# Altium schematic sheet Gagabiro_supply_cover.SchDoc: Gagabiro Power Supply Cover Letter
size 292 x 193 mm; CheckedBy: João Victor Colombari Carlet; Author: João Victor Colombari Carlet; CompanyName: SEL; DrawnBy: João Victor Colombari Carlet; Engineer: João Victor Colombari Carlet; Organization: SEL; Address1: EESC - USP; Address2: 400, Trabalhador São-Carlense Av.; Address3: 13566-590, São Carlos; Address4: São Paulo, Brazil; DocumentNumber: Doc Num; Revision: 0; SheetNumber: 1; SheetTotal: 4
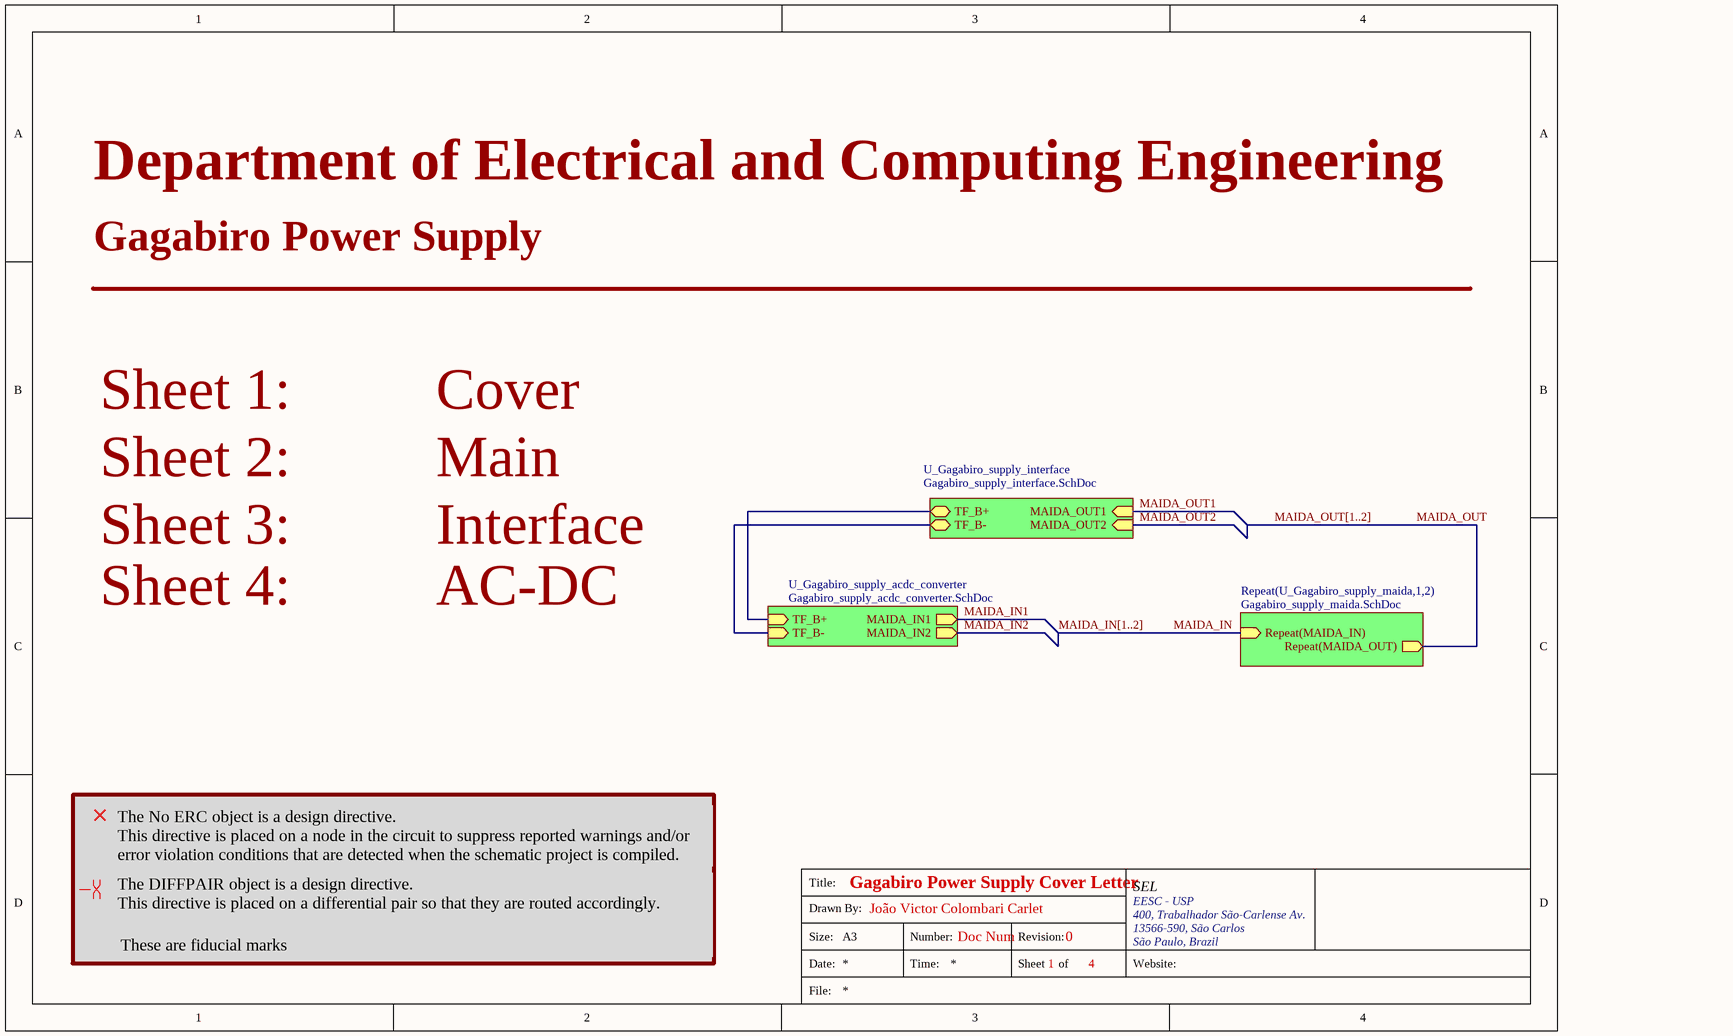
[diagram p0: Gagabiro_supply_cover.SchDoc]

## Sub-sheets
Repeat(U_Gagabiro_supply_maida,1,2) = Gagabiro_supply_maida.SchDoc: Repeat(MAIDA_IN) (in), Repeat(MAIDA_OUT) (out)
U_Gagabiro_supply_acdc_converter = Gagabiro_supply_acdc_converter.SchDoc: TF_B+ (in), TF_B- (in), MAIDA_IN1 (out), MAIDA_IN2 (out)
U_Gagabiro_supply_interface = Gagabiro_supply_interface.SchDoc: TF_B+ (bidir), TF_B- (bidir), MAIDA_OUT1 (in), MAIDA_OUT2 (in)

## Nets
MAIDA_IN: sheet Repeat(U_Gagabiro_supply_maida,1,2)/Repeat(MAIDA_IN)
MAIDA_IN1: sheet U_Gagabiro_supply_acdc_converter/MAIDA_IN1
MAIDA_IN2: sheet U_Gagabiro_supply_acdc_converter/MAIDA_IN2
MAIDA_OUT: sheet Repeat(U_Gagabiro_supply_maida,1,2)/Repeat(MAIDA_OUT)
MAIDA_OUT1: sheet U_Gagabiro_supply_interface/MAIDA_OUT1
MAIDA_OUT2: sheet U_Gagabiro_supply_interface/MAIDA_OUT2
(unnamed): sheet U_Gagabiro_supply_interface/TF_B+, sheet U_Gagabiro_supply_acdc_converter/TF_B+
(unnamed): sheet U_Gagabiro_supply_interface/TF_B-, sheet U_Gagabiro_supply_acdc_converter/TF_B-

## Buses and harness runs
bus MAIDA_IN[1..2]
bus MAIDA_OUT[1..2]

## Layout directives
differential pair: (no net found under the mark)

## Notes on the sheet
- Department of Electrical and Computing Engineering
- Gagabiro Power Supply
- Sheet 1:          Cover
- Sheet 2:          Main
- Sheet 3:          Interface
- Sheet 4:          AC-DC
- The No ERC object is a design directive.
  This directive is placed on a node in the circuit to suppress reported warnings and/or error violation conditions that are detected when the schematic project is compiled.
- The DIFFPAIR object is a design directive.
  This directive is placed on a differential pair so that they are routed accordingly.
- These are fiducial marks
- Title:
- Drawn By:
- Size:
- Date:
- File:
- A3
- Number:
- Time:
- Revision:
- Sheet
- of
- Website: